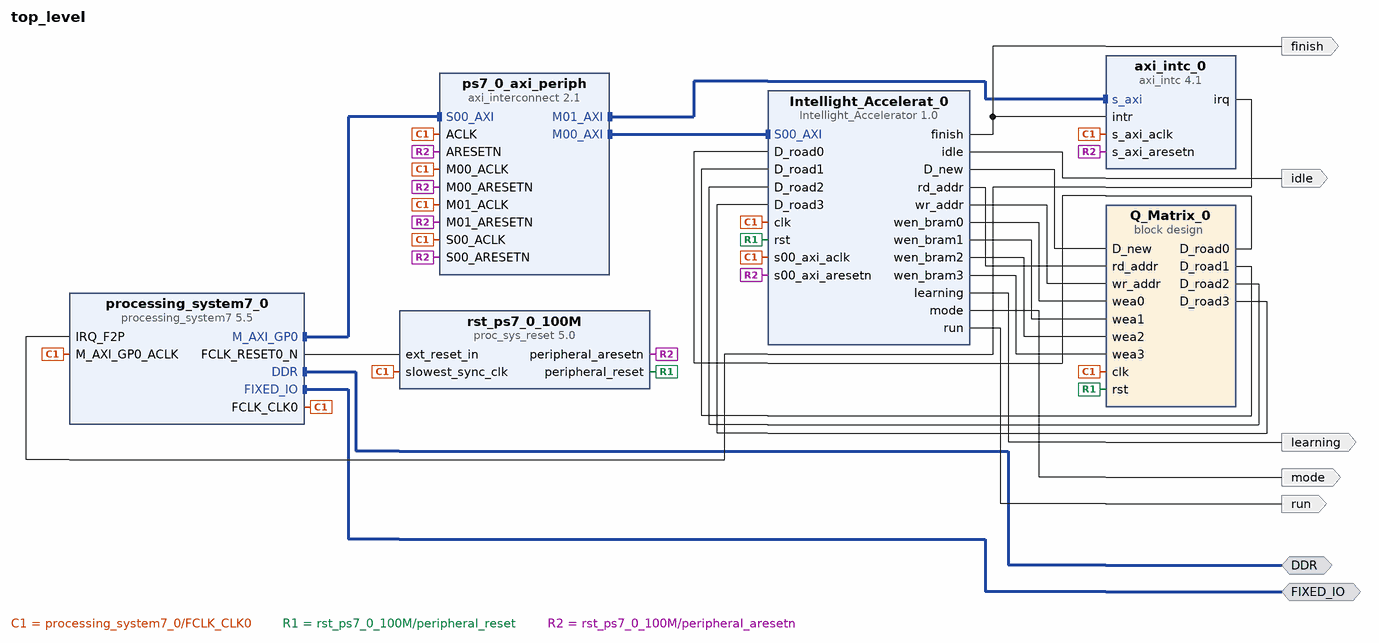
[diagram p0: block diagram of the top level]
# Vivado block design top_level, xc7z020clg400-1, Vivado 2022.1
create_bd_design top_level

create_bd_intf_port -mode Master -vlnv xilinx.com:interface:ddrx_rtl:1.0 DDR
create_bd_intf_port -mode Master -vlnv xilinx.com:display_processing_system7:fixedio_rtl:1.0 FIXED_IO
create_bd_port -dir O idle
create_bd_port -dir O mode
create_bd_port -dir O run
create_bd_port -dir O learning
create_bd_port -dir O finish

create_bd_cell -type ip -vlnv xilinx.com:ip:processing_system7:5.5 processing_system7_0
set_property -dict [list \
  CONFIG.PCW_APU_PERIPHERAL_FREQMHZ 650 \
  CONFIG.PCW_CRYSTAL_PERIPHERAL_FREQMHZ 50 \
  CONFIG.PCW_ENET0_ENET0_IO {MIO 16 .. 27} \
  CONFIG.PCW_ENET0_GRP_MDIO_ENABLE 1 \
  CONFIG.PCW_ENET0_GRP_MDIO_IO {MIO 52 .. 53} \
  CONFIG.PCW_ENET0_PERIPHERAL_ENABLE 1 \
  CONFIG.PCW_ENET0_RESET_ENABLE 1 \
  CONFIG.PCW_ENET0_RESET_IO {MIO 9} \
  CONFIG.PCW_ENET_RESET_ENABLE 1 \
  CONFIG.PCW_ENET_RESET_SELECT {Share reset pin} \
  CONFIG.PCW_FPGA0_PERIPHERAL_FREQMHZ 95 \
  CONFIG.PCW_FPGA1_PERIPHERAL_FREQMHZ 50 \
  CONFIG.PCW_GPIO_MIO_GPIO_ENABLE 1 \
  CONFIG.PCW_GPIO_MIO_GPIO_IO MIO \
  CONFIG.PCW_I2C_RESET_ENABLE 1 \
  CONFIG.PCW_IRQ_F2P_INTR 1 \
  CONFIG.PCW_M_AXI_GP0_FREQMHZ 10 \
  CONFIG.PCW_PERIPHERAL_BOARD_PRESET part0 \
  CONFIG.PCW_PRESET_BANK1_VOLTAGE {LVCMOS 1.8V} \
  CONFIG.PCW_QSPI_GRP_FBCLK_ENABLE 1 \
  CONFIG.PCW_QSPI_GRP_FBCLK_IO {MIO 8} \
  CONFIG.PCW_QSPI_GRP_SINGLE_SS_ENABLE 1 \
  CONFIG.PCW_QSPI_GRP_SINGLE_SS_IO {MIO 1 .. 6} \
  CONFIG.PCW_QSPI_PERIPHERAL_ENABLE 1 \
  CONFIG.PCW_QSPI_QSPI_IO {MIO 1 .. 6} \
  CONFIG.PCW_SD0_GRP_CD_ENABLE 1 \
  CONFIG.PCW_SD0_GRP_CD_IO {MIO 47} \
  CONFIG.PCW_SD0_GRP_WP_ENABLE 0 \
  CONFIG.PCW_SD0_PERIPHERAL_ENABLE 1 \
  CONFIG.PCW_SD0_SD0_IO {MIO 40 .. 45} \
  CONFIG.PCW_SDIO_PERIPHERAL_FREQMHZ 50 \
  CONFIG.PCW_SINGLE_QSPI_DATA_MODE x4 \
  CONFIG.PCW_UART0_PERIPHERAL_ENABLE 1 \
  CONFIG.PCW_UART0_UART0_IO {MIO 14 .. 15} \
  CONFIG.PCW_UART1_PERIPHERAL_ENABLE 0 \
  CONFIG.PCW_UART_PERIPHERAL_FREQMHZ 100 \
  CONFIG.PCW_UIPARAM_DDR_BUS_WIDTH {16 Bit} \
  CONFIG.PCW_UIPARAM_DDR_FREQ_MHZ 525 \
  CONFIG.PCW_UIPARAM_DDR_PARTNO {MT41J256M16 RE-125} \
  CONFIG.PCW_USB0_PERIPHERAL_ENABLE 1 \
  CONFIG.PCW_USB0_RESET_ENABLE 1 \
  CONFIG.PCW_USB0_RESET_IO {MIO 46} \
  CONFIG.PCW_USB0_USB0_IO {MIO 28 .. 39} \
  CONFIG.PCW_USB_RESET_ENABLE 1 \
  CONFIG.PCW_USB_RESET_SELECT {Share reset pin} \
  CONFIG.PCW_USE_FABRIC_INTERRUPT 1 \
] [get_bd_cells processing_system7_0]
# 495 more settings of processing_system7_0 are not shown: defaults, MIO pin electricals, DDR timing, and values the tool derives
create_bd_cell -type container -reference Q_Matrix Q_Matrix_0
set_property -dict [list \
  CONFIG.ACTIVE_SIM_BD Q_Matrix.bd \
  CONFIG.ACTIVE_SYNTH_BD Q_Matrix.bd \
  CONFIG.ENABLE_DFX 0 \
  CONFIG.LIST_SIM_BD Q_Matrix.bd \
  CONFIG.LIST_SYNTH_BD Q_Matrix.bd \
  CONFIG.LOCK_PROPAGATE 0 \
] [get_bd_cells Q_Matrix_0]
create_bd_cell -type ip -vlnv xilinx.com:ip:axi_intc:4.1 axi_intc_0
set_property -dict {CONFIG.C_IRQ_CONNECTION 1} [get_bd_cells axi_intc_0]
create_bd_cell -type ip -vlnv xilinx.com:ip:axi_interconnect:2.1 ps7_0_axi_periph
set_property -dict {CONFIG.NUM_MI 2} [get_bd_cells ps7_0_axi_periph]
create_bd_cell -type ip -vlnv xilinx.com:ip:proc_sys_reset:5.0 rst_ps7_0_100M
create_bd_cell -type ip -vlnv xilinx.com:user:Intellight_Accelerator:1.0 Intellight_Accelerat_0
set_property -dict {CONFIG.L_WIDTH 4 CONFIG.Q_WIDTH 16} [get_bd_cells Intellight_Accelerat_0]

# ---- connections ----

connect_bd_intf_net [get_bd_intf_ports DDR] [get_bd_intf_pins processing_system7_0/DDR]
connect_bd_intf_net [get_bd_intf_ports FIXED_IO] [get_bd_intf_pins processing_system7_0/FIXED_IO]
connect_bd_intf_net [get_bd_intf_pins processing_system7_0/M_AXI_GP0] [get_bd_intf_pins ps7_0_axi_periph/S00_AXI]
connect_bd_intf_net [get_bd_intf_pins ps7_0_axi_periph/M00_AXI] [get_bd_intf_pins Intellight_Accelerat_0/S00_AXI]
connect_bd_intf_net [get_bd_intf_pins ps7_0_axi_periph/M01_AXI] [get_bd_intf_pins axi_intc_0/s_axi]
connect_bd_net [get_bd_pins Intellight_Accelerat_0/D_new] [get_bd_pins Q_Matrix_0/D_new]
connect_bd_net [get_bd_pins Intellight_Accelerat_0/finish] [get_bd_pins axi_intc_0/intr] [get_bd_ports finish]
connect_bd_net [get_bd_pins Intellight_Accelerat_0/idle] [get_bd_ports idle]
connect_bd_net [get_bd_pins Intellight_Accelerat_0/learning] [get_bd_ports learning]
connect_bd_net [get_bd_pins Intellight_Accelerat_0/mode] [get_bd_ports mode]
connect_bd_net [get_bd_pins Intellight_Accelerat_0/rd_addr] [get_bd_pins Q_Matrix_0/rd_addr]
connect_bd_net [get_bd_pins Intellight_Accelerat_0/run] [get_bd_ports run]
connect_bd_net [get_bd_pins Intellight_Accelerat_0/wr_addr] [get_bd_pins Q_Matrix_0/wr_addr]
connect_bd_net [get_bd_pins Q_Matrix_0/D_road0] [get_bd_pins Intellight_Accelerat_0/D_road0]
connect_bd_net [get_bd_pins Q_Matrix_0/D_road1] [get_bd_pins Intellight_Accelerat_0/D_road1]
connect_bd_net [get_bd_pins Q_Matrix_0/D_road2] [get_bd_pins Intellight_Accelerat_0/D_road2]
connect_bd_net [get_bd_pins Q_Matrix_0/D_road3] [get_bd_pins Intellight_Accelerat_0/D_road3]
connect_bd_net [get_bd_pins axi_intc_0/irq] [get_bd_pins processing_system7_0/IRQ_F2P]
connect_bd_net [get_bd_pins processing_system7_0/FCLK_CLK0] \
  [get_bd_pins processing_system7_0/M_AXI_GP0_ACLK] [get_bd_pins Q_Matrix_0/clk] [get_bd_pins axi_intc_0/s_axi_aclk] \
  [get_bd_pins ps7_0_axi_periph/ACLK] [get_bd_pins ps7_0_axi_periph/S00_ACLK] [get_bd_pins ps7_0_axi_periph/M00_ACLK] \
  [get_bd_pins ps7_0_axi_periph/M01_ACLK] [get_bd_pins rst_ps7_0_100M/slowest_sync_clk] \
  [get_bd_pins Intellight_Accelerat_0/clk] [get_bd_pins Intellight_Accelerat_0/s00_axi_aclk]
connect_bd_net [get_bd_pins processing_system7_0/FCLK_RESET0_N] [get_bd_pins rst_ps7_0_100M/ext_reset_in]
connect_bd_net -net rst_1 [get_bd_pins rst_ps7_0_100M/peripheral_reset] [get_bd_pins Q_Matrix_0/rst] [get_bd_pins Intellight_Accelerat_0/rst]
connect_bd_net [get_bd_pins rst_ps7_0_100M/peripheral_aresetn] \
  [get_bd_pins axi_intc_0/s_axi_aresetn] [get_bd_pins ps7_0_axi_periph/ARESETN] [get_bd_pins ps7_0_axi_periph/S00_ARESETN] \
  [get_bd_pins ps7_0_axi_periph/M00_ARESETN] [get_bd_pins ps7_0_axi_periph/M01_ARESETN] \
  [get_bd_pins Intellight_Accelerat_0/s00_axi_aresetn]
connect_bd_net -net wea0_1 [get_bd_pins Intellight_Accelerat_0/wen_bram0] [get_bd_pins Q_Matrix_0/wea0]
connect_bd_net -net wea1_1 [get_bd_pins Intellight_Accelerat_0/wen_bram1] [get_bd_pins Q_Matrix_0/wea1]
connect_bd_net -net wea2_1 [get_bd_pins Intellight_Accelerat_0/wen_bram2] [get_bd_pins Q_Matrix_0/wea2]
connect_bd_net -net wea3_1 [get_bd_pins Intellight_Accelerat_0/wen_bram3] [get_bd_pins Q_Matrix_0/wea3]

# ---- address map ----
assign_bd_address -offset 0x41800000 -range 64K -target_address_space [get_bd_addr_spaces processing_system7_0/Data] [get_bd_addr_segs axi_intc_0/S_AXI/Reg]
assign_bd_address -offset 0x43C00000 -range 64K -target_address_space [get_bd_addr_spaces processing_system7_0/Data] [get_bd_addr_segs Intellight_Accelerat_0/S00_AXI/S00_AXI_reg]

validate_bd_design
save_bd_design
